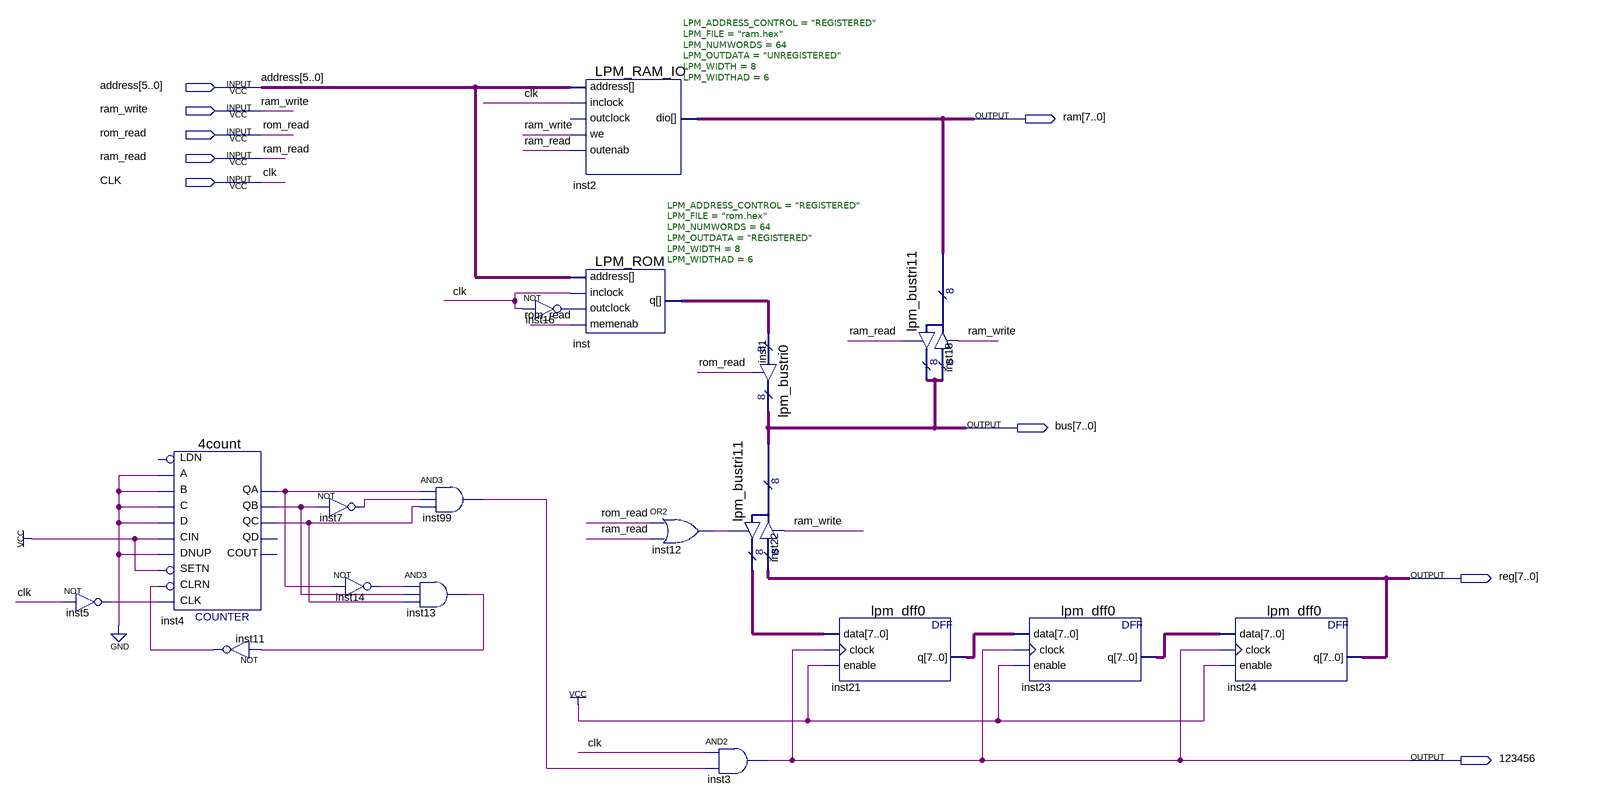
[diagram p0: schematic sheet]
// Quartus schematic block1.bdf as structural Verilog: 18 symbols, 9 pins
module block1 (
  input  [5:0] address,
  input  ram_write,
  input  rom_read,
  input  ram_read,
  input  CLK,
  output [7:0] ram,
  output [7:0] bus,
  output [7:0] \reg ,
  output \123456 
);

  wire inst4_qa, inst4_qb, inst4_qc, inst5_out, inst7_out, inst11_out, inst12_out, inst13_out, inst14_out,
       inst16_out, inst99_out;
  wire [7:0] inst21_q, inst22_result, inst23_q, inst_q;

  not inst5 (inst5_out, CLK);
  \4count  inst4 (
    .B(1'b0), .A(1'b0), .D(1'b0), .CIN(1'b1), .DNUP(1'b0), .CLK(inst5_out), .SETN(1'b1), .C(1'b0),
    .CLRN(inst11_out), .QA(inst4_qa), .QB(inst4_qb), .QC(inst4_qc));  // open: LDN, QD, COUT
  not inst11 (inst11_out, inst13_out);
  not inst7 (inst7_out, inst4_qb);
  not inst14 (inst14_out, inst4_qa);
  and inst13 (inst13_out, inst14_out, inst4_qb, inst4_qc);
  and inst99 (inst99_out, inst4_qa, inst7_out, inst4_qc);
  not inst16 (inst16_out, CLK);
  LPM_RAM_IO #(.LPM_ADDRESS_CONTROL("REGISTERED"), .LPM_FILE("ram.hex"), .LPM_NUMWORDS(64), .LPM_OUTDATA("UNREGISTERED"), .LPM_WIDTH(8), .LPM_WIDTHAD(6)) inst2 (
    .address(address), .inclock(CLK), .we(ram_write), .outenab(ram_read), .dio(ram));  // open: outclock
  LPM_ROM #(.LPM_ADDRESS_CONTROL("REGISTERED"), .LPM_FILE("rom.hex"), .LPM_NUMWORDS(64), .LPM_OUTDATA("REGISTERED"), .LPM_WIDTH(8), .LPM_WIDTHAD(6)) inst (
    .address(address), .inclock(CLK), .outclock(inst16_out), .memenab(rom_read), .q(inst_q));
  or inst12 (inst12_out, rom_read, ram_read);
  and inst3 (\123456 , CLK, inst99_out);
  lpm_bustri0 inst1 (.enabledt(rom_read), .data(inst_q), .tridata(bus));
  lpm_bustri11 inst22 (
    .enabledt(ram_write), .data(\reg ), .enabletr(inst12_out), .result(inst22_result), .tridata(bus));
  lpm_dff0 inst21 (.data(inst22_result), .clock(\123456 ), .enable(1'b1), .q(inst21_q));
  lpm_bustri11 inst18 (.enabledt(ram_write), .data(bus), .enabletr(ram_read), .result(bus), .tridata(ram));
  lpm_dff0 inst23 (.data(inst21_q), .clock(\123456 ), .enable(1'b1), .q(inst23_q));
  lpm_dff0 inst24 (.data(inst23_q), .clock(\123456 ), .enable(1'b1), .q(\reg ));
endmodule
